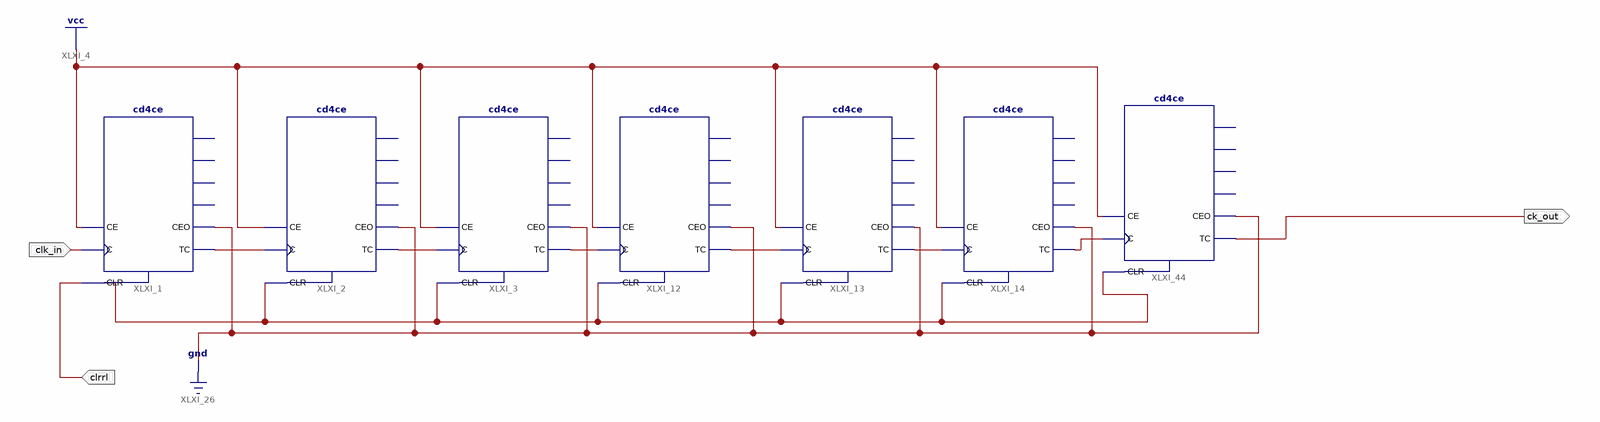
[diagram p0: schematic sheet 1]
// Xilinx ISE schematic CLK2HZ.sch (spartan6) as structural Verilog: 7 symbols, 3 ports
module CLK2HZ (
  input  clk_in,
  input  clrrl,
  output ck_out
);

  wire XLXN_1, XLXN_2, XLXN_4, XLXN_5, XLXN_6, XLXN_113;

  cd4ce XLXI_1 (.C(clk_in), .CE(1'b1), .CLR(clrrl), .CEO(1'b0), .TC(XLXN_1));  // open: Q0, Q1, Q2, Q3
  cd4ce XLXI_2 (.C(XLXN_1), .CE(1'b1), .CLR(clrrl), .CEO(1'b0), .TC(XLXN_2));  // open: Q0, Q1, Q2, Q3
  cd4ce XLXI_3 (.C(XLXN_2), .CE(1'b1), .CLR(clrrl), .CEO(1'b0), .TC(XLXN_4));  // open: Q0, Q1, Q2, Q3
  cd4ce XLXI_12 (.C(XLXN_4), .CE(1'b1), .CLR(clrrl), .CEO(1'b0), .TC(XLXN_5));  // open: Q0, Q1, Q2, Q3
  cd4ce XLXI_13 (.C(XLXN_5), .CE(1'b1), .CLR(clrrl), .CEO(1'b0), .TC(XLXN_6));  // open: Q0, Q1, Q2, Q3
  cd4ce XLXI_14 (.C(XLXN_6), .CE(1'b1), .CLR(clrrl), .CEO(1'b0), .TC(XLXN_113));  // open: Q0, Q1, Q2, Q3
  cd4ce XLXI_44 (.C(XLXN_113), .CE(1'b1), .CLR(clrrl), .CEO(1'b0), .TC(ck_out));  // open: Q0, Q1, Q2, Q3
endmodule
